# Altium schematic sheet Incremental Encoder.SchDoc
size A4; CompanyName: Technische Hochschule Nürnberg Georg Simon Ohm; Organization: UltraZohm; Address1: Kesslerplatz 12; Address2: 90489 Nürnberg; Address3: GERMANY; DocumentNumber: 7; SheetNumber: 7; SheetTotal: 12; Website: www.ultrazohm.com
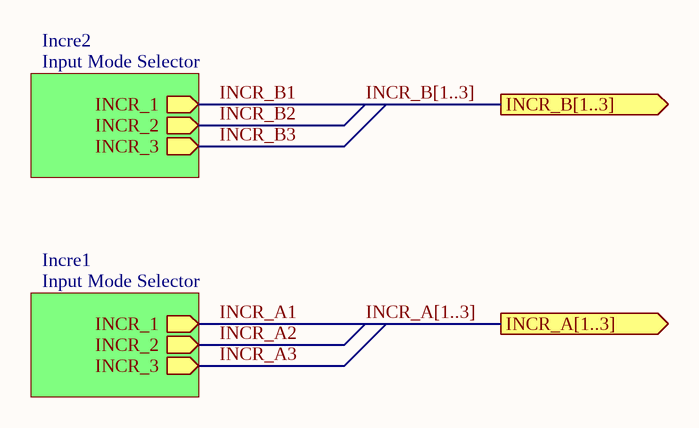
[diagram p0: Incremental Encoder.SchDoc]

## Sub-sheets
Incre1 = Input Mode Selector: INCR_2 (out), INCR_1 (out), INCR_3 (out)
Incre2 = Input Mode Selector: INCR_2 (out), INCR_1 (out), INCR_3 (out)

## Ports
INCR_A[1..3] (out), INCR_B[1..3] (out)

## Nets
INCR_A1: sheet Incre1/INCR_1
INCR_A2: sheet Incre1/INCR_2
INCR_A3: sheet Incre1/INCR_3
INCR_B1: sheet Incre2/INCR_1
INCR_B2: sheet Incre2/INCR_2
INCR_B3: sheet Incre2/INCR_3

## Buses and harness runs
bus INCR_A[1..3] = port INCR_A[1..3]
bus INCR_B[1..3] = port INCR_B[1..3]

## Notes on the sheet
- Title
- Revision:
- Design Engineer:
- Date:
- Project:
- Sheet
- of